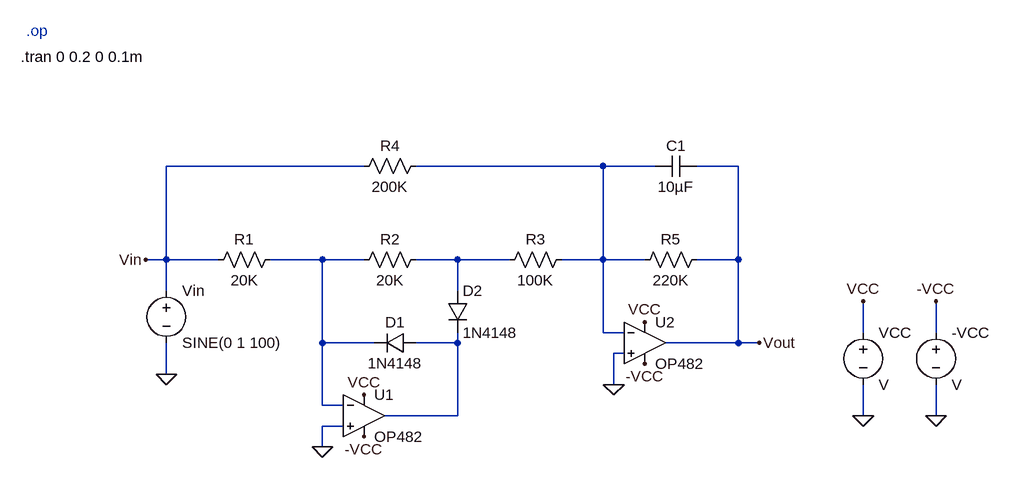
[diagram p0: schematic Draft5.asc]
Draft5.asc, the LTspice schematic file:
Version 4
SHEET 1 1152 680
WIRE 192 96 -112 96
WIRE 560 96 272 96
WIRE 640 96 560 96
WIRE 768 96 704 96
WIRE -112 240 -112 96
WIRE -112 240 -144 240
WIRE -32 240 -112 240
WIRE 128 240 48 240
WIRE 192 240 128 240
WIRE 336 240 272 240
WIRE 416 240 336 240
WIRE 560 240 560 96
WIRE 560 240 496 240
WIRE 624 240 560 240
WIRE 768 240 768 96
WIRE 768 240 704 240
WIRE -112 288 -112 240
WIRE 336 288 336 240
WIRE 560 352 560 240
WIRE 592 352 560 352
WIRE 960 352 960 304
WIRE 1072 352 1072 304
WIRE 128 368 128 240
WIRE 208 368 128 368
WIRE 336 368 336 352
WIRE 336 368 272 368
WIRE 768 368 768 240
WIRE 768 368 656 368
WIRE 800 368 768 368
WIRE 592 384 576 384
WIRE -112 416 -112 368
WIRE 576 432 576 384
WIRE 128 464 128 368
WIRE 160 464 128 464
WIRE 336 480 336 368
WIRE 336 480 224 480
WIRE 960 480 960 432
WIRE 1072 480 1072 432
WIRE 160 496 128 496
WIRE 128 528 128 496
FLAG 128 528 0
FLAG -112 416 0
FLAG 576 432 0
FLAG 960 480 0
FLAG 1072 480 0
FLAG 800 368 Vout
FLAG -144 240 Vin
FLAG 960 304 VCC
FLAG 624 336 VCC
FLAG 192 448 VCC
FLAG 1072 304 -VCC
FLAG 624 400 -VCC
FLAG 192 512 -VCC
SYMBOL OP482 192 416 R0
SYMATTR InstName U1
SYMBOL Res 64 224 R90
WINDOW 0 0 56 VBottom 2
WINDOW 3 32 56 VTop 2
SYMATTR InstName R1
SYMATTR Value 20K
SYMBOL Res 288 224 R90
WINDOW 0 0 56 VBottom 2
WINDOW 3 32 56 VTop 2
SYMATTR InstName R2
SYMATTR Value 20K
SYMBOL Voltage -112 272 R0
SYMATTR InstName Vin
SYMATTR Value SINE(0 1 100)
SYMBOL Res 512 224 R90
WINDOW 0 0 56 VBottom 2
WINDOW 3 32 56 VTop 2
SYMATTR InstName R3
SYMATTR Value 100K
SYMBOL OP482 624 304 R0
SYMATTR InstName U2
SYMBOL Res 720 224 R90
WINDOW 0 0 56 VBottom 2
WINDOW 3 32 56 VTop 2
SYMATTR InstName R5
SYMATTR Value 220K
SYMBOL Cap 704 80 R90
WINDOW 0 0 32 VBottom 2
WINDOW 3 32 32 VTop 2
SYMATTR InstName C1
SYMATTR Value 10µF
SYMBOL Res 288 80 R90
WINDOW 0 0 56 VBottom 2
WINDOW 3 32 56 VTop 2
SYMATTR InstName R4
SYMATTR Value 200K
SYMBOL Voltage 960 336 R0
SYMATTR InstName VCC
SYMBOL Voltage 1072 336 R0
SYMATTR InstName -VCC
SYMBOL diode 320 288 R0
SYMATTR InstName D2
SYMATTR Value 1N4148
SYMBOL diode 272 352 R90
WINDOW 0 0 32 VBottom 2
WINDOW 3 32 32 VTop 2
SYMATTR InstName D1
SYMATTR Value 1N4148
TEXT -336 -72 Left 2 !.tran 0 0.2 0 0.1m
TEXT -328 -112 Left 2 ;.op

The netlist it stands for:
* Draft5.asc
* U1: OP482 (symbol OP482 not available, pins judged from their places): In+=0 In-=N002 V+=VCC V-=-VCC OUT=N004
R1 N002 Vin 20K
R2 N003 N002 20K
Vin Vin 0 SINE(0 1 100)
R3 N001 N003 100K
* U2: OP482 (symbol OP482 not available, pins judged from their places): In+=0 In-=N001 V+=VCC V-=-VCC OUT=Vout
R5 Vout N001 220K
C1 Vout N001 10µF
R4 N001 Vin 200K
VCC VCC 0 V
V§-VCC -VCC 0 V
D2 N003 N004 1N4148
D1 N004 N002 1N4148
.model D D
.lib standard.dio
.tran 0 0.2 0 0.1m
* .op
.backanno
.end